# EAGLE schematic UPL_KeyBoard (EAGLE 8.0.1)
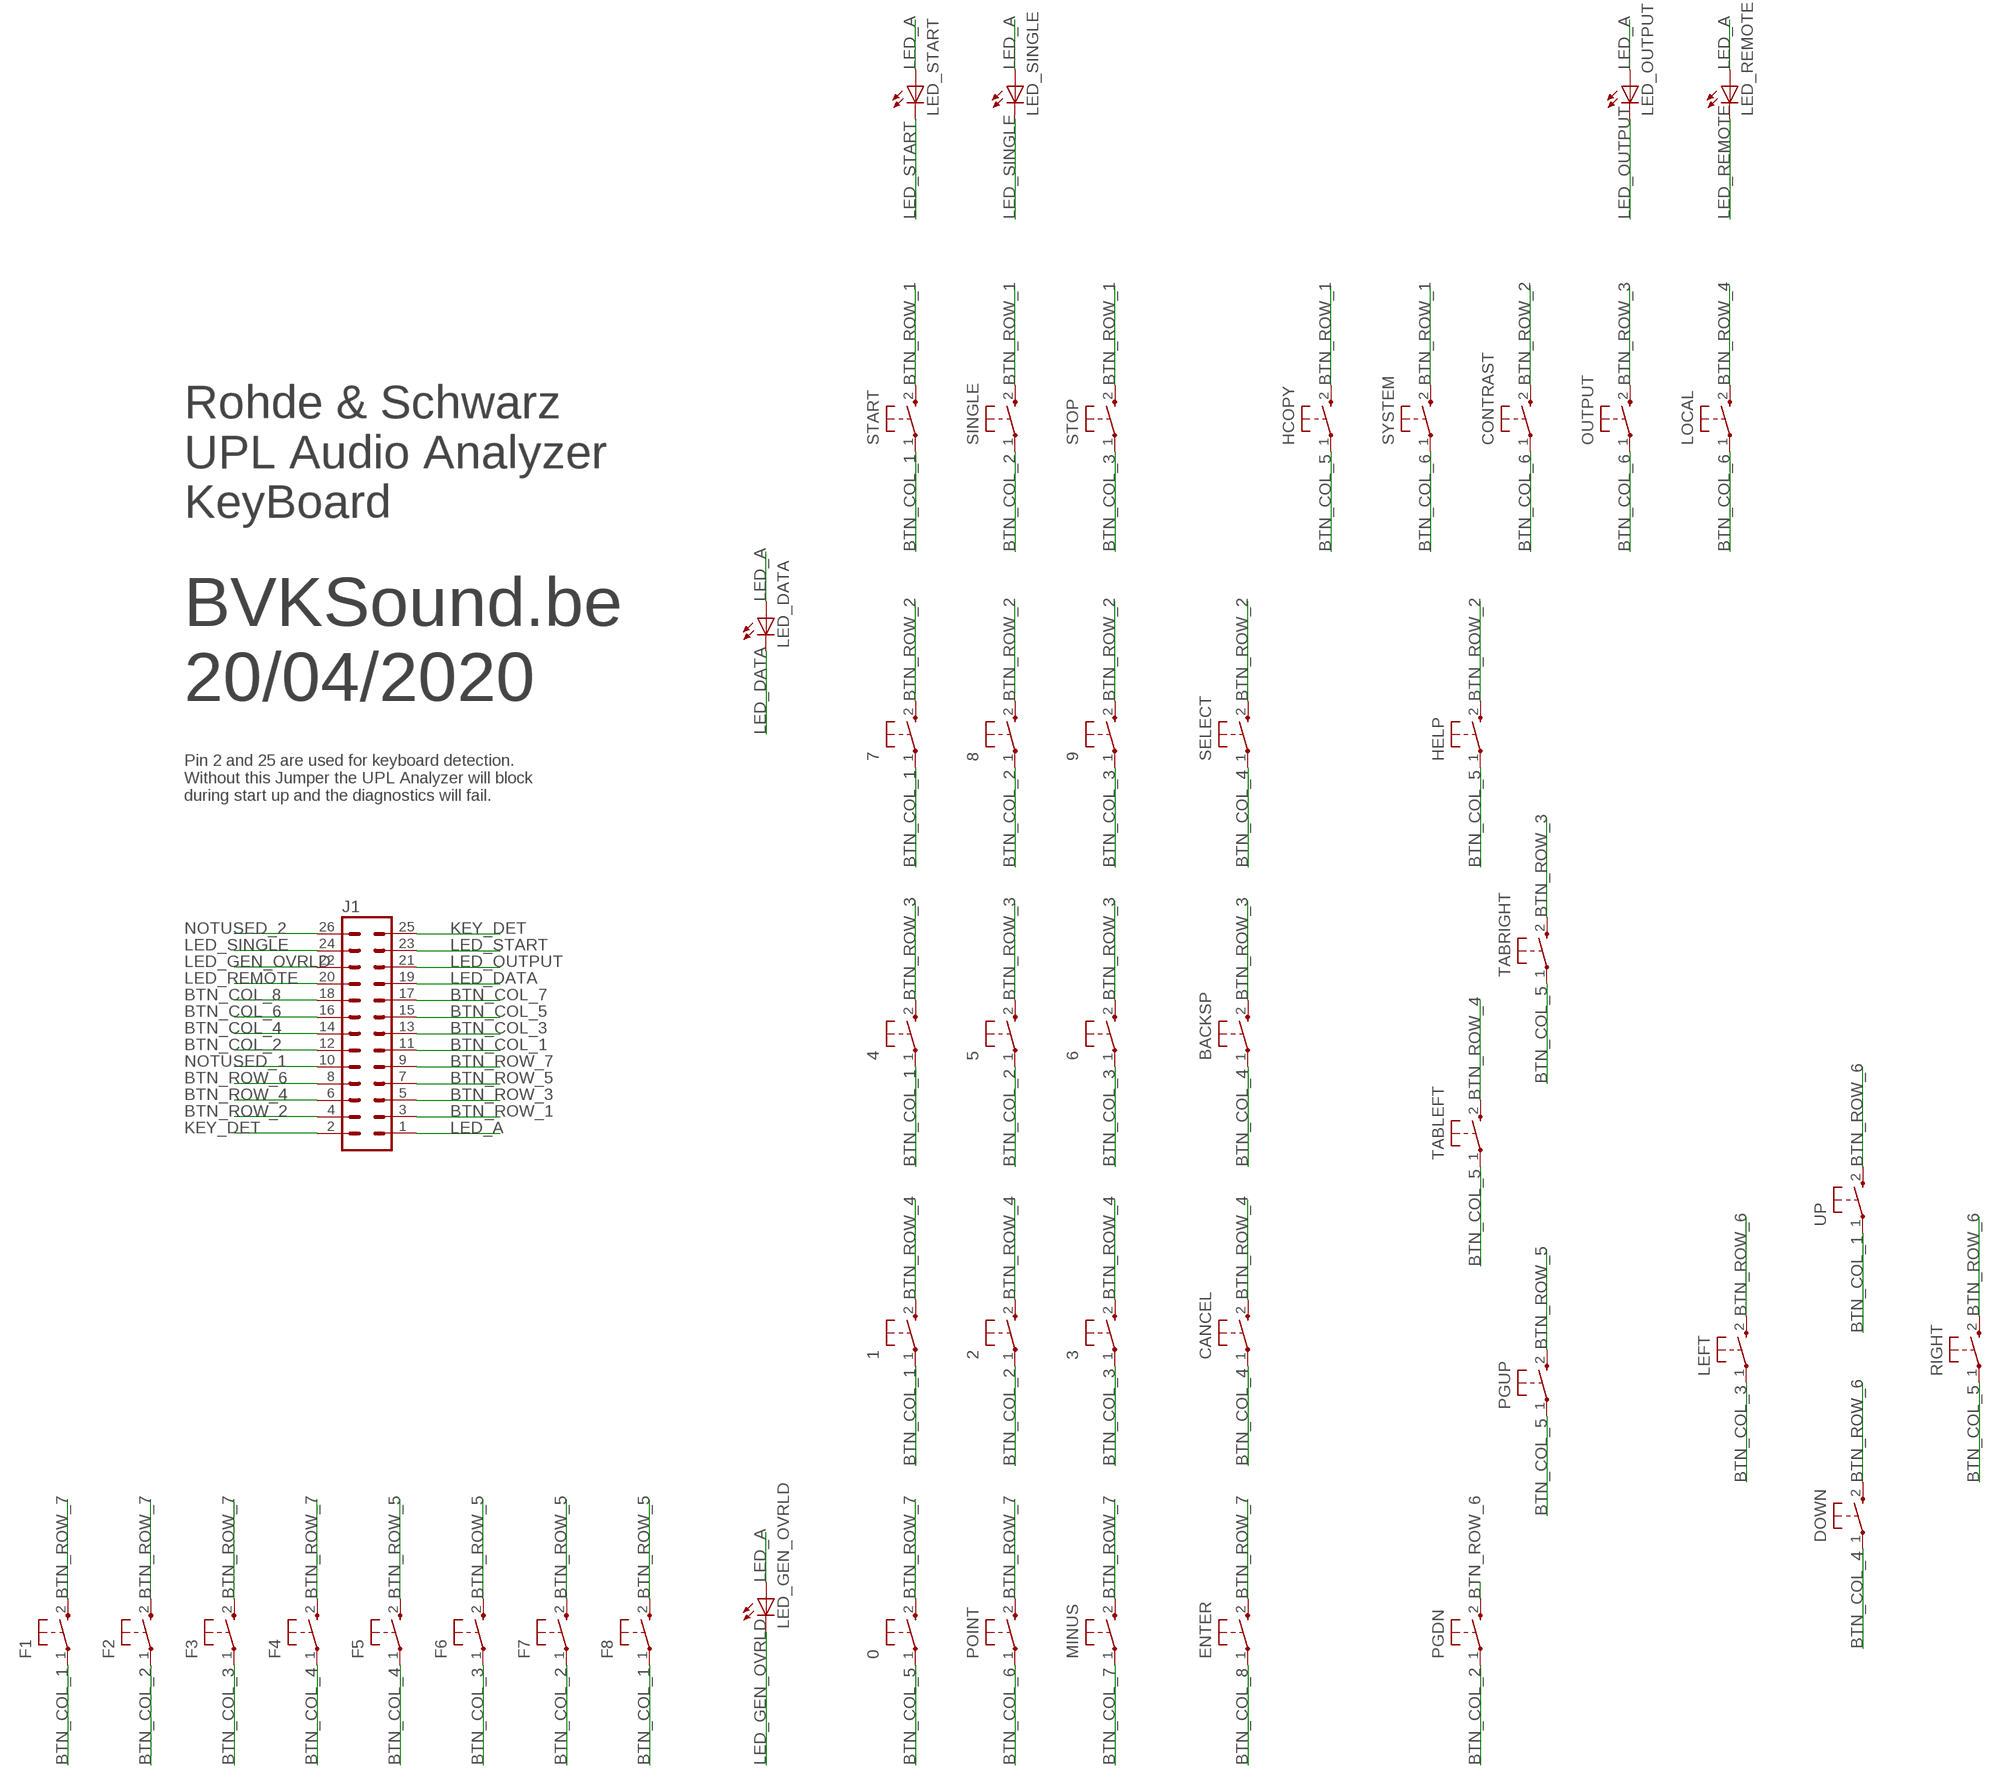
[diagram p0: schematic, sheet 1]

## Parts
0  ALPS_SKQYAFE010  [ALPS_SKQYAFE010]
1  ALPS_SKQYAFE010  [ALPS_SKQYAFE010]
2  ALPS_SKQYAFE010  [ALPS_SKQYAFE010]
3  ALPS_SKQYAFE010  [ALPS_SKQYAFE010]
4  ALPS_SKQYAFE010  [ALPS_SKQYAFE010]
5  ALPS_SKQYAFE010  [ALPS_SKQYAFE010]
6  ALPS_SKQYAFE010  [ALPS_SKQYAFE010]
7  ALPS_SKQYAFE010  [ALPS_SKQYAFE010]
8  ALPS_SKQYAFE010  [ALPS_SKQYAFE010]
9  ALPS_SKQYAFE010  [ALPS_SKQYAFE010]
BACKSP  ALPS_SKQYAFE010  [ALPS_SKQYAFE010]
CANCEL  ALPS_SKQYAFE010  [ALPS_SKQYAFE010]
CONTRAST  ALPS_SKQYAFE010  [ALPS_SKQYAFE010]
DOWN  ALPS_SKQYAFE010  [ALPS_SKQYAFE010]
ENTER  ALPS_SKQYAFE010  [ALPS_SKQYAFE010]
F1  ALPS_SKQYAFE010  [ALPS_SKQYAFE010]
F2  ALPS_SKQYAFE010  [ALPS_SKQYAFE010]
F3  ALPS_SKQYAFE010  [ALPS_SKQYAFE010]
F4  ALPS_SKQYAFE010  [ALPS_SKQYAFE010]
F5  ALPS_SKQYAFE010  [ALPS_SKQYAFE010]
F6  ALPS_SKQYAFE010  [ALPS_SKQYAFE010]
F7  ALPS_SKQYAFE010  [ALPS_SKQYAFE010]
F8  ALPS_SKQYAFE010  [ALPS_SKQYAFE010]
HCOPY  ALPS_SKQYAFE010  [ALPS_SKQYAFE010]
HELP  ALPS_SKQYAFE010  [ALPS_SKQYAFE010]
J1  ML26  [ML26]
LED_DATA  LEDCHIPLED_1206  [CHIPLED_1206]
LED_GEN_OVRLD  LEDCHIPLED_1206  [CHIPLED_1206]
LED_OUTPUT  LEDCHIPLED_1206  [CHIPLED_1206]
LED_REMOTE  LEDCHIPLED_1206  [CHIPLED_1206]
LED_SINGLE  LEDCHIPLED_1206  [CHIPLED_1206]
LED_START  LEDCHIPLED_1206  [CHIPLED_1206]
LEFT  ALPS_SKQYAFE010  [ALPS_SKQYAFE010]
LOCAL  ALPS_SKQYAFE010  [ALPS_SKQYAFE010]
MINUS  ALPS_SKQYAFE010  [ALPS_SKQYAFE010]
OUTPUT  ALPS_SKQYAFE010  [ALPS_SKQYAFE010]
PGDN  ALPS_SKQYAFE010  [ALPS_SKQYAFE010]
PGUP  ALPS_SKQYAFE010  [ALPS_SKQYAFE010]
POINT  ALPS_SKQYAFE010  [ALPS_SKQYAFE010]
RIGHT  ALPS_SKQYAFE010  [ALPS_SKQYAFE010]
SELECT  ALPS_SKQYAFE010  [ALPS_SKQYAFE010]
SINGLE  ALPS_SKQYAFE010  [ALPS_SKQYAFE010]
START  ALPS_SKQYAFE010  [ALPS_SKQYAFE010]
STOP  ALPS_SKQYAFE010  [ALPS_SKQYAFE010]
SYSTEM  ALPS_SKQYAFE010  [ALPS_SKQYAFE010]
TABLEFT  ALPS_SKQYAFE010  [ALPS_SKQYAFE010]
TABRIGHT  ALPS_SKQYAFE010  [ALPS_SKQYAFE010]
UP  ALPS_SKQYAFE010  [ALPS_SKQYAFE010]

## Nets
BTN_COL_1: 1.1 4.1 7.1 F1.1 F8.1 J1.11 START.1 UP.1
BTN_COL_2: 2.1 5.1 8.1 F2.1 F7.1 J1.12 PGDN.1 SINGLE.1
BTN_COL_3: 3.1 6.1 9.1 F3.1 F6.1 J1.13 LEFT.1 STOP.1
BTN_COL_4: BACKSP.1 CANCEL.1 DOWN.1 F4.1 F5.1 J1.14 SELECT.1
BTN_COL_5: 0.1 HCOPY.1 HELP.1 J1.15 PGUP.1 RIGHT.1 TABLEFT.1 TABRIGHT.1
BTN_COL_6: CONTRAST.1 J1.16 LOCAL.1 OUTPUT.1 POINT.1 SYSTEM.1
BTN_COL_7: J1.17 MINUS.1
BTN_COL_8: ENTER.1 J1.18
BTN_ROW_1: HCOPY.2 J1.3 SINGLE.2 START.2 STOP.2 SYSTEM.2
BTN_ROW_2: 7.2 8.2 9.2 CONTRAST.2 HELP.2 J1.4 SELECT.2
BTN_ROW_3: 4.2 5.2 6.2 BACKSP.2 J1.5 OUTPUT.2 TABRIGHT.2
BTN_ROW_4: 1.2 2.2 3.2 CANCEL.2 J1.6 LOCAL.2 TABLEFT.2
BTN_ROW_5: F5.2 F6.2 F7.2 F8.2 J1.7 PGUP.2
BTN_ROW_6: DOWN.2 J1.8 LEFT.2 PGDN.2 RIGHT.2 UP.2
BTN_ROW_7: 0.2 ENTER.2 F1.2 F2.2 F3.2 F4.2 J1.9 MINUS.2 POINT.2
KEY_DET: J1.2 J1.25
LED_A: J1.1 LED_DATA.A LED_GEN_OVRLD.A LED_OUTPUT.A LED_REMOTE.A LED_SINGLE.A LED_START.A
LED_DATA: J1.19 LED_DATA.C
LED_GEN_OVRLD: J1.22 LED_GEN_OVRLD.C
LED_OUTPUT: J1.21 LED_OUTPUT.C
LED_REMOTE: J1.20 LED_REMOTE.C
LED_SINGLE: J1.24 LED_SINGLE.C
LED_START: J1.23 LED_START.C
NOTUSED_1: J1.10
NOTUSED_2: J1.26

## Notes on the sheet
- Rohde & Schwarz
  UPL Audio Analyzer
  KeyBoard
- BVKSound.be
  20/04/2020
- Pin 2 and 25 are used for keyboard detection.
  Without this Jumper the UPL Analyzer will block
  during start up and the diagnostics will fail.

## Library data of the parts
0 1-9 BACKSP CANCEL CONTRAST DOWN ENTER F1-F8 HCOPY HELP LEFT LOCAL MINUS OUTPUT PGDN PGUP POINT RIGHT SELECT SINGLE START STOP SYSTEM TABLEFT TABRIGHT UP = bvk:ALPS_SKQYAFE010
J1 = con-harting-ml:ML26: HARTING; OC_FARNELL: unknown; OC_NEWARK: unknown
LED_DATA LED_GEN_OVRLD LED_OUTPUT LED_REMOTE LED_SINGLE LED_START = adafruit:LED: LED OSRAM: - CHIPLED LG R971, LG N971, LY N971, LG Q971, LY Q971, LO R971, LY R971 LH N974, LH R974 LS Q976, LO Q976, LY Q976 LO Q996 - Hyper CHIPLED LW Q18S LB Q993, LB Q99A, LB R99A - SideLED LS A670, LO A670, LY A670, LG A670, LP A670 LB A673, LV A673, LT A673, LW A673 LH A674 LY A675 LS A676, LA A676, LO A676, LY A676, LW A676 LS A679, LY A679, LG A679 - Hyper Micro SIDELED® LS Y876, LA Y876, LO Y876, LY Y876 LT Y87S - SmartLED LW L88C, LW L88S LB L89C, LB L89S, LG L890 LS L89K, LO L89K, LY L89K LS L896, LA L896, LO L896, LY L896 - TOPLED LS T670, LO T670, LY T670, LG T670, LP T670 LSG T670, LSP T670, LSY T670, LOP T670, LYG T670 LG T671, LOG T671, LSG T671 LB T673, LV T673, LT T673, LW T673 LH T674 LS T676, LA T676, LO T676, LY T676, LB T676, LH T676, LSB T676, LW T676 LB T67C, LV T67C, LT T67C, LS T67K, LO T67K, LY T67K, LW E67C LS E67B, LA E67B, LO E67B, LY E67B, LB E67C, LV E67C, LT E67C LW T67C LS T679, LY T679, LG T679 LS T770, LO T770, LY T770, LG T770, LP T770 LB T773, LV T773, LT T773, LW T773 LH T774 LS E675, LA E675, LY E675, LS T675 LS T776, LA T776, LO T776, LY T776, LB T776 LHGB T686 LT T68C, LB T68C - Hyper Mini TOPLED® LB M676 - Mini TOPLED Santana® LG M470 LS M47K, LO M47K, LY M47K Source: http://www.osram.convergy.de/